# EasyEDA Pro project 毕设.eprj, schematic Schematic2
Board Name: Board2; Create Date: 2025-03-01; Page Name: P1; Project Name: 毕设; Schematic Name: Schematic2; Update Date: 2025-03-02; Company: 嘉立创EDA; Page Size: A4; Version: V1.0
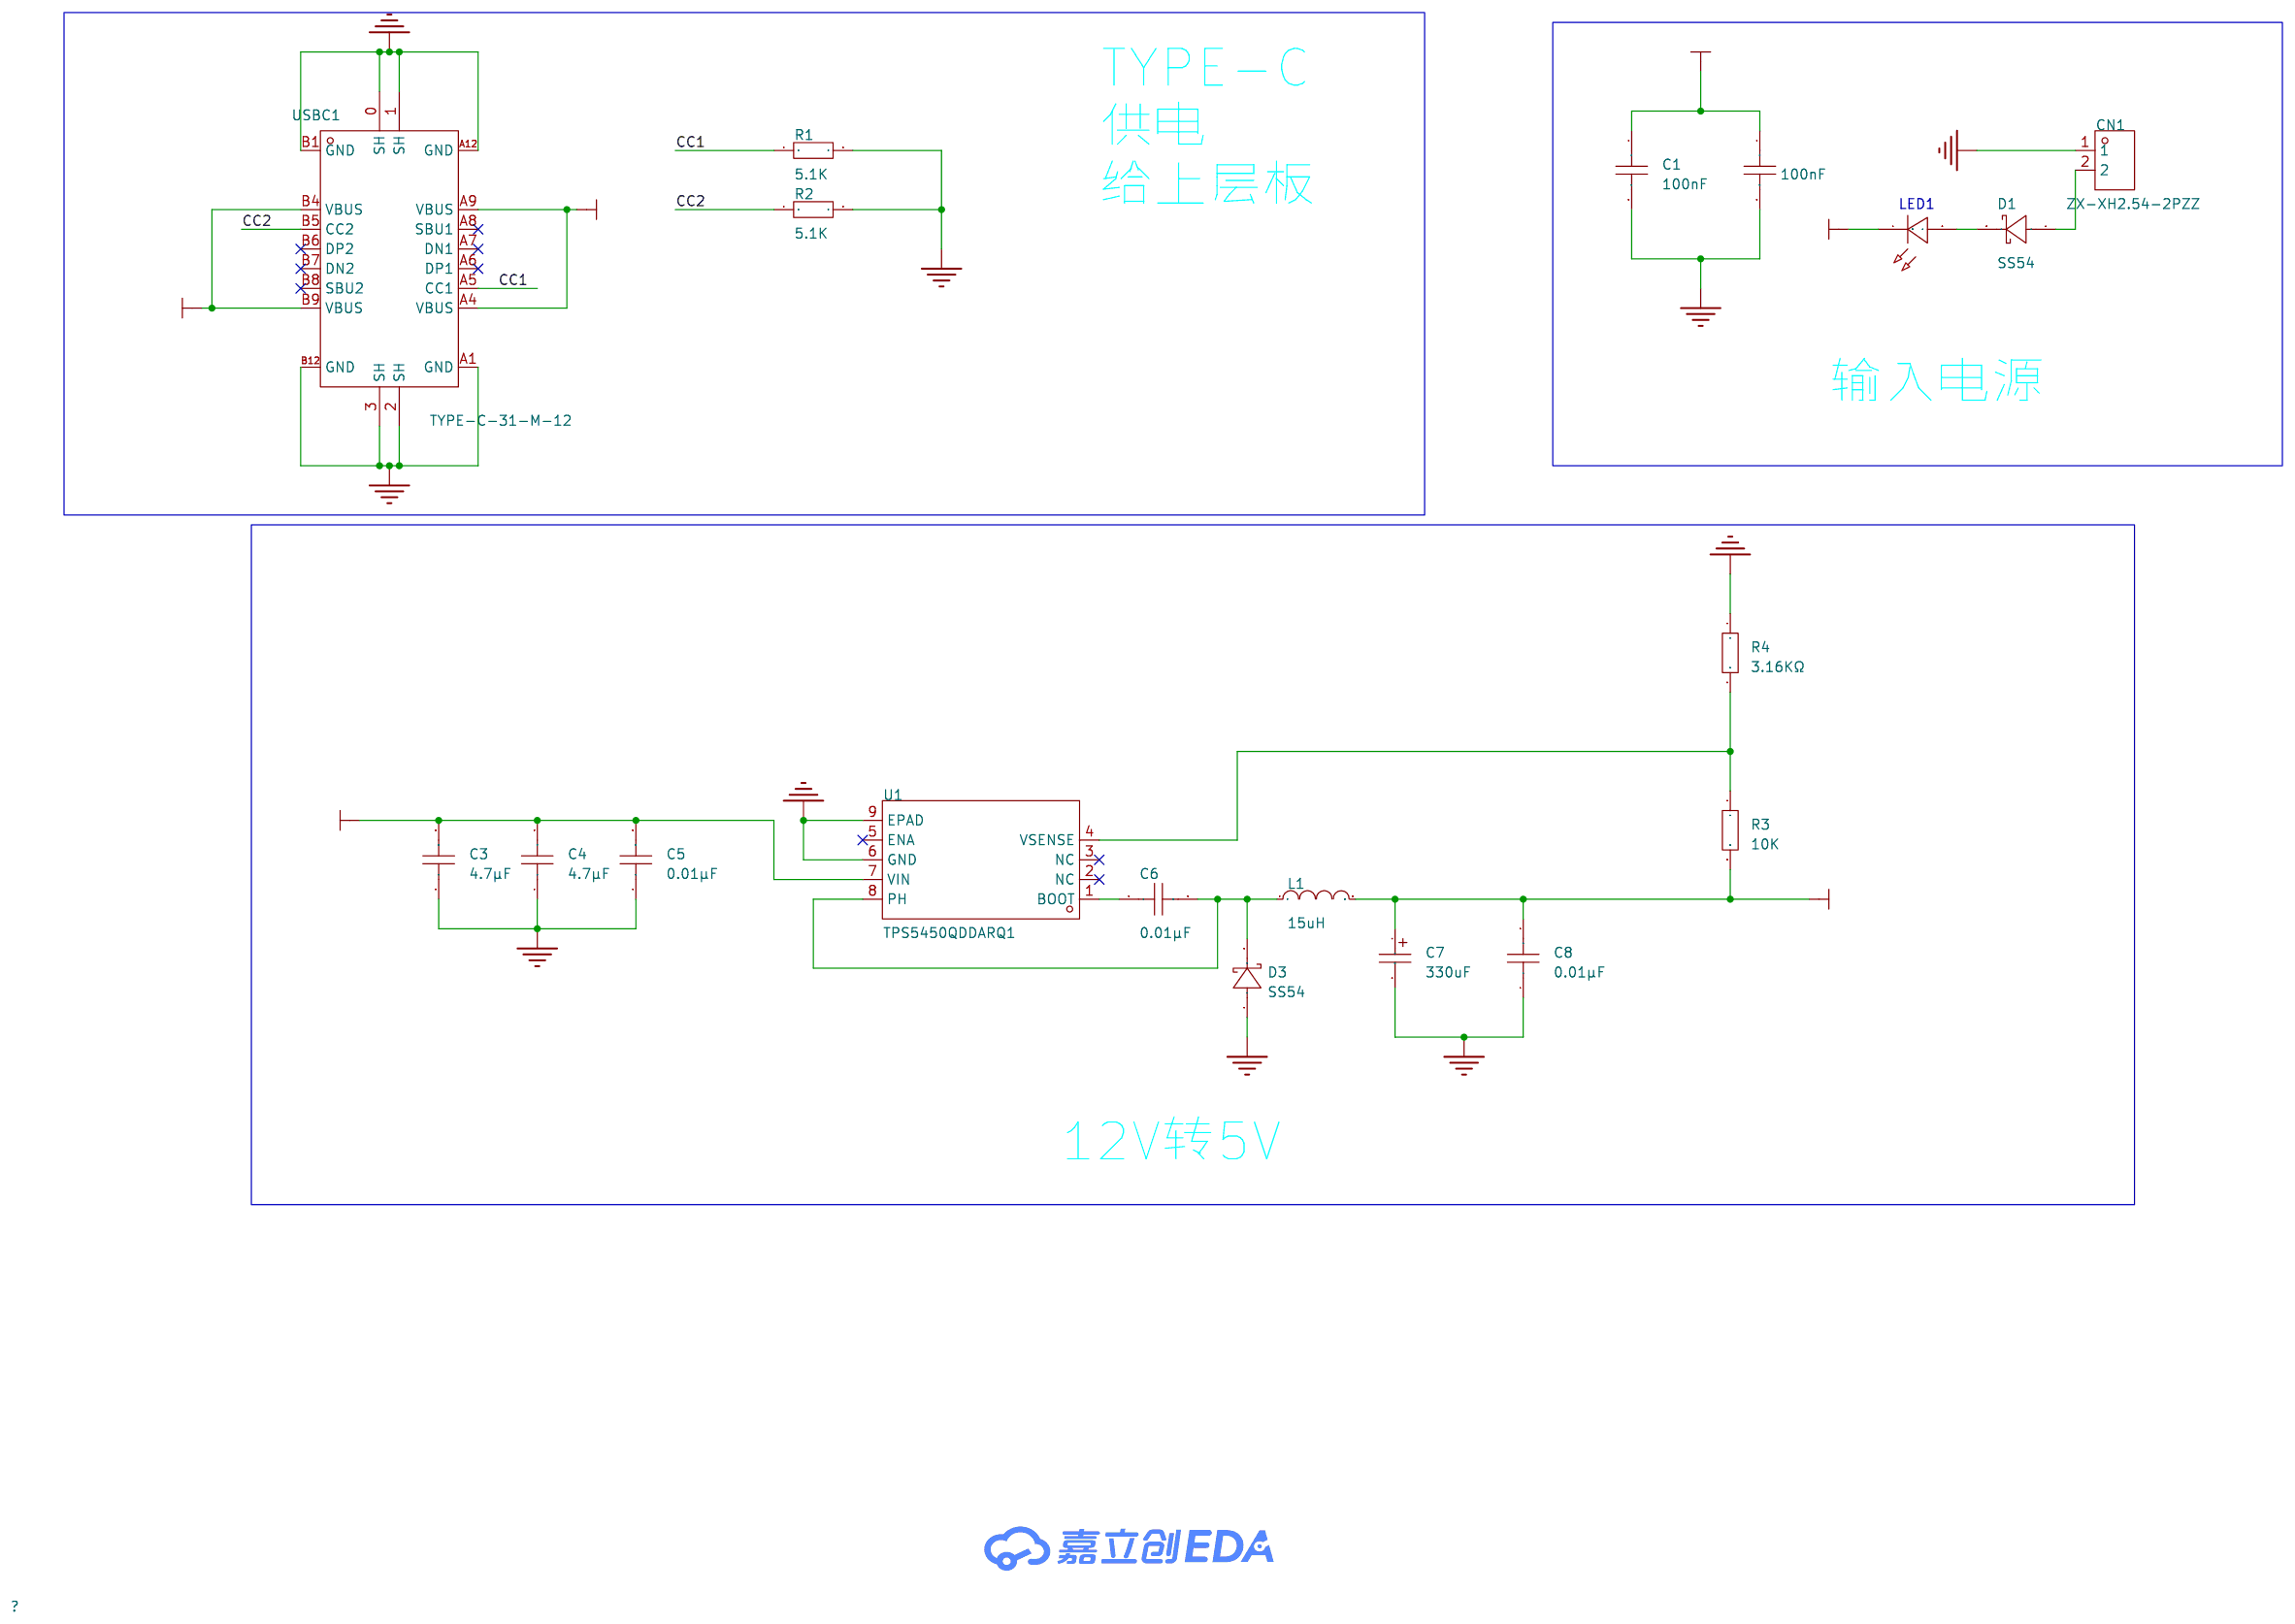
[diagram p1: schematic sheet]

## Parts
C1  100nF  [C0603]
C2  100nF  [C0603]
C3  4.7μF  [C0603]
C4  4.7μF  [C0603]
C5  0.01μF  [C0603]
C6  0.01μF  [C0603]
C7  330uF  [C_Ele_SMD_3x5.4mm]
C8  0.01μF  [C0603]
CN1  ZX-XH2.54-2PZZ  [CONN-TH_2P-P2.50_HX25003-2A]
D1  SS54  [SMA_L4.3-W2.6-LS5.0-FD]
D3  SS54  [SMA_L4.3-W2.6-LS5.0-FD]
L1  15uH  [L0603]
LED1  -  [LED_0603]
R1  5.1K  [R0603]
R2  5.1K  [R0603]
R3  10K  [R0603]
R4  3.16KΩ  [R0603]
U1  TPS5450QDDARQ1  [SOIC-8_L4.9-W3.9-P1.27-LS6.0-BL-EP]
USBC1  TYPE-C-31-M-12  [USB-C_SMD-TYPE-C-31-M-12]

## Library data of the parts
C1-C6 C8 = CAP_0603: Supplier Footprint: 0603
C7 = C_Ele_SMD_3x5.4mm: Supplier Footprint: SMD,3x5.4mm
CN1 = ZX-XH2.54-2PZZ: LCSC Part Name: 1x2P 间距:2.5mm 直插 系列:XH; Supplier Part: C7429632; Manufacturer: Megastar(兆星); Supplier Footprint: 插件,P=2.5mm; JLCPCB Part Class: 扩展库; Datasheet: https://atta.szlcsc.com/upload/public/pdf/source/20230619/19BA6947230AA44A04D3EDD65E618FD0.pdf; Supplier: LCSC; Pins Structure: 1x2P; Pitch: 2.5mm; Mounting Type: 直插; Reference Series: XH; Number of Pins: 2P; Number of Rows: 1; Number of PINs Per Row: 2; Rated Current: 3A; Contact Material: 黄铜; Contact Plating: 锡; Operating Temperature: -25℃~+85℃; Rated Voltage (Max): 250V; Plastic Material: PA66; Flame Retardant Rating: UL94V-0; Color: 白色; Z-Height of the Board: 7mm; X-Length of Bottom Edge on Board (Spacing Line): 7.5mm; Y-Width of Bottom Edge on Board: 5.9mm
D1 D3 = SS54_C7420369: LCSC Part Name: 电压:40V 电流:5A; Supplier Part: C7420369; Manufacturer: 宏迦橙; Supplier Footprint: SMA(DO-214AC); JLCPCB Part Class: 扩展库; Datasheet: https://atta.szlcsc.com/upload/public/pdf/source/20230828/254C3882F8647358AD9F60DD73611B5E.pdf; Supplier: LCSC; Diode Configuration: 独立式; Forward Voltage (Vf@If): 550mV@5.0A; Reverse Voltage (Vr): 40V; Rectified Current: 5A; Reverse Leakage Current (Ir): 50uA@40V
L1 = L_0603
LED1 = LED_0603-G: Supplier Footprint: 0603
R1-R4 = Res_0603: Supplier Footprint: 0603
U1 = TPS5450QDDARQ1: LCSC Part Name: 5A宽输入范围降压转换器; Supplier Part: C181270; Manufacturer: TI(德州仪器); Supplier Footprint: SOIC-8-EP; JLCPCB Part Class: 扩展库; Datasheet: https://www.ti.com/cn/lit/gpn/tps5450-q1; Supplier: LCSC; Function: 降压型; Output Type: 可调; Input Voltage: 5.5V~36V; Output Voltage: 1.221V~32.04V; Output Current: 5A; Switching Frequency: 500kHz; Operating Temperature: -40℃~+125℃@(TJ); Synchronous Rectification: 否; Number of Outputs: 1; Topology: 降压式; Switch tube (built-in/external): 内置
USBC1 = TYPE-C-31-M-12: LCSC Part Name: Type-C 母; Supplier Part: C165948; Manufacturer: 韩国韩荣; Supplier Footprint: SMD; JLCPCB Part Class: 扩展库; Datasheet: https://atta.szlcsc.com/upload/public/pdf/source/20220525/466408E853115E789EDB0DDC29077C05.pdf; Supplier: LCSC; Connector Type: Type-C; Gender: 母; Number of Contacts: 16P; Number of Ports: 1; Current Rating - Power (Max): 5A

## Nets
GND: C1.2 C2.2 C3.1 C4.1 C5.1 C7.2 C8.1 CN1.1 D3.1(A) R1.2 R2.2 R4.1 U1.6(GND) U1.9(EPAD) USBC1.0(SH) USBC1.1(SH) USBC1.2(SH) USBC1.3(SH) USBC1.A1(GND) USBC1.A12(GND) USBC1.B1(GND) USBC1.B12(GND)
VCC12V: C1.1 C2.1 C3.2 C4.2 C5.2 LED1.1(C) U1.7(VIN)
VCC+5V: C7.1 C8.2 L1.2 R3.2 USBC1.A4(VBUS) USBC1.A9(VBUS) USBC1.B4(VBUS) USBC1.B9(VBUS)
CC1: R1.1 USBC1.A5(CC1)
CC2: R2.1 USBC1.B5(CC2)
$1N220: CN1.2 D1.1(A)
$1N3615: D1.2(K) LED1.2(A)
$1N3863: C6.2 D3.2(K) L1.1 U1.8(PH)
$1N3888: C6.1 U1.1(BOOT)
$1N3897: R3.1 R4.2 U1.4(VSENSE)

Not connected (* = marked no-connect by the designer): U1 2(NC)* 3(NC)* 5(ENA)*; USBC1 A6(DP1)* A7(DN1)* A8(SBU1)* B6(DP2)* B7(DN2)* B8(SBU2)*

## Notes on the sheet
- TYPE-C
  供电
  给上层板
- 输入电源
- 12V转5V
